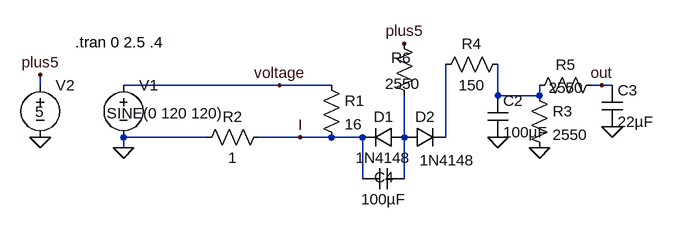
[diagram p0: schematic ac_current_proto1.asc]
ac_current_proto1.asc, the LTspice schematic file:
Version 4
SHEET 1 880 680
WIRE -128 112 -128 96
WIRE 240 112 0 112
WIRE 320 112 240 112
WIRE 736 112 720 112
WIRE 752 112 736 112
WIRE 576 128 576 80
WIRE 640 128 640 112
WIRE 640 128 576 128
WIRE 128 192 0 192
WIRE 272 192 208 192
WIRE 320 192 272 192
WIRE 368 192 320 192
WIRE 432 192 432 128
WIRE 496 192 496 80
WIRE 0 208 0 192
WIRE 368 256 368 192
WIRE 432 256 432 192
FLAG 272 192 I
FLAG 240 112 voltage
FLAG 736 112 out
FLAG 576 192 0
FLAG 640 208 0
FLAG 752 176 0
FLAG -128 192 0
FLAG -128 96 plus5
FLAG 432 48 plus5
FLAG 0 208 0
SYMBOL voltage 0 96 R0
WINDOW 123 0 0 Left 2
WINDOW 39 0 0 Left 2
WINDOW 3 -26 59 Left 2
SYMATTR InstName V1
SYMATTR Value SINE(0 120 120)
SYMBOL res 304 96 R0
SYMATTR InstName R1
SYMATTR Value 16
SYMBOL diode 432 208 R270
WINDOW 0 32 32 VTop 2
WINDOW 3 -4 66 VBottom 2
SYMATTR InstName D2
SYMATTR Value 1N4148
SYMBOL cap 560 128 R0
SYMATTR InstName C2
SYMATTR Value 100µF
SYMBOL res 624 112 R0
SYMATTR InstName R3
SYMATTR Value 2550
SYMBOL res 480 96 R270
WINDOW 0 32 56 VTop 2
WINDOW 3 0 56 VBottom 2
SYMATTR InstName R4
SYMATTR Value 150
SYMBOL res 624 128 R270
WINDOW 0 32 56 VTop 2
WINDOW 3 28 57 VBottom 2
SYMATTR InstName R5
SYMATTR Value 2550
SYMBOL cap 736 112 R0
SYMATTR InstName C3
SYMATTR Value 22µF
SYMBOL res 224 176 R90
WINDOW 0 0 56 VBottom 2
WINDOW 3 32 56 VTop 2
SYMATTR InstName R2
SYMATTR Value 1
SYMBOL voltage -128 96 R0
WINDOW 3 -8 57 Left 2
WINDOW 123 0 0 Left 2
WINDOW 39 0 0 Left 2
SYMATTR InstName V2
SYMATTR Value 5
SYMBOL res 416 32 R0
WINDOW 0 -4 38 Left 2
WINDOW 3 -13 78 Left 2
SYMATTR InstName R6
SYMATTR Value 2550
SYMBOL cap 432 240 R90
WINDOW 0 29 31 VBottom 2
WINDOW 3 32 32 VTop 2
SYMATTR InstName C4
SYMATTR Value 100µF
SYMBOL diode 432 176 R90
WINDOW 0 0 32 VBottom 2
WINDOW 3 32 32 VTop 2
SYMATTR InstName D1
SYMATTR Value 1N4148
TEXT -74 46 Left 2 !.tran 0 2.5 .4

The netlist it stands for:
* ac_current_proto1.asc
V1 voltage 0 SINE(0 120 120)
R1 voltage I 16
D2 N002 N003 1N4148
C2 N001 0 100µF
R3 N001 0 2550
R4 N003 N001 150
R5 N001 out 2550
C3 out 0 22µF
R2 I 0 1
V2 plus5 0 5
R6 plus5 N002 2550
C4 N002 I 100µF
D1 N002 I 1N4148
.model D D
.lib standard.dio
.tran 0 2.5 .4
.backanno
.end